# EAGLE schematic EMC02 (EAGLE 7.2.0)

## Sheet 1 of 2
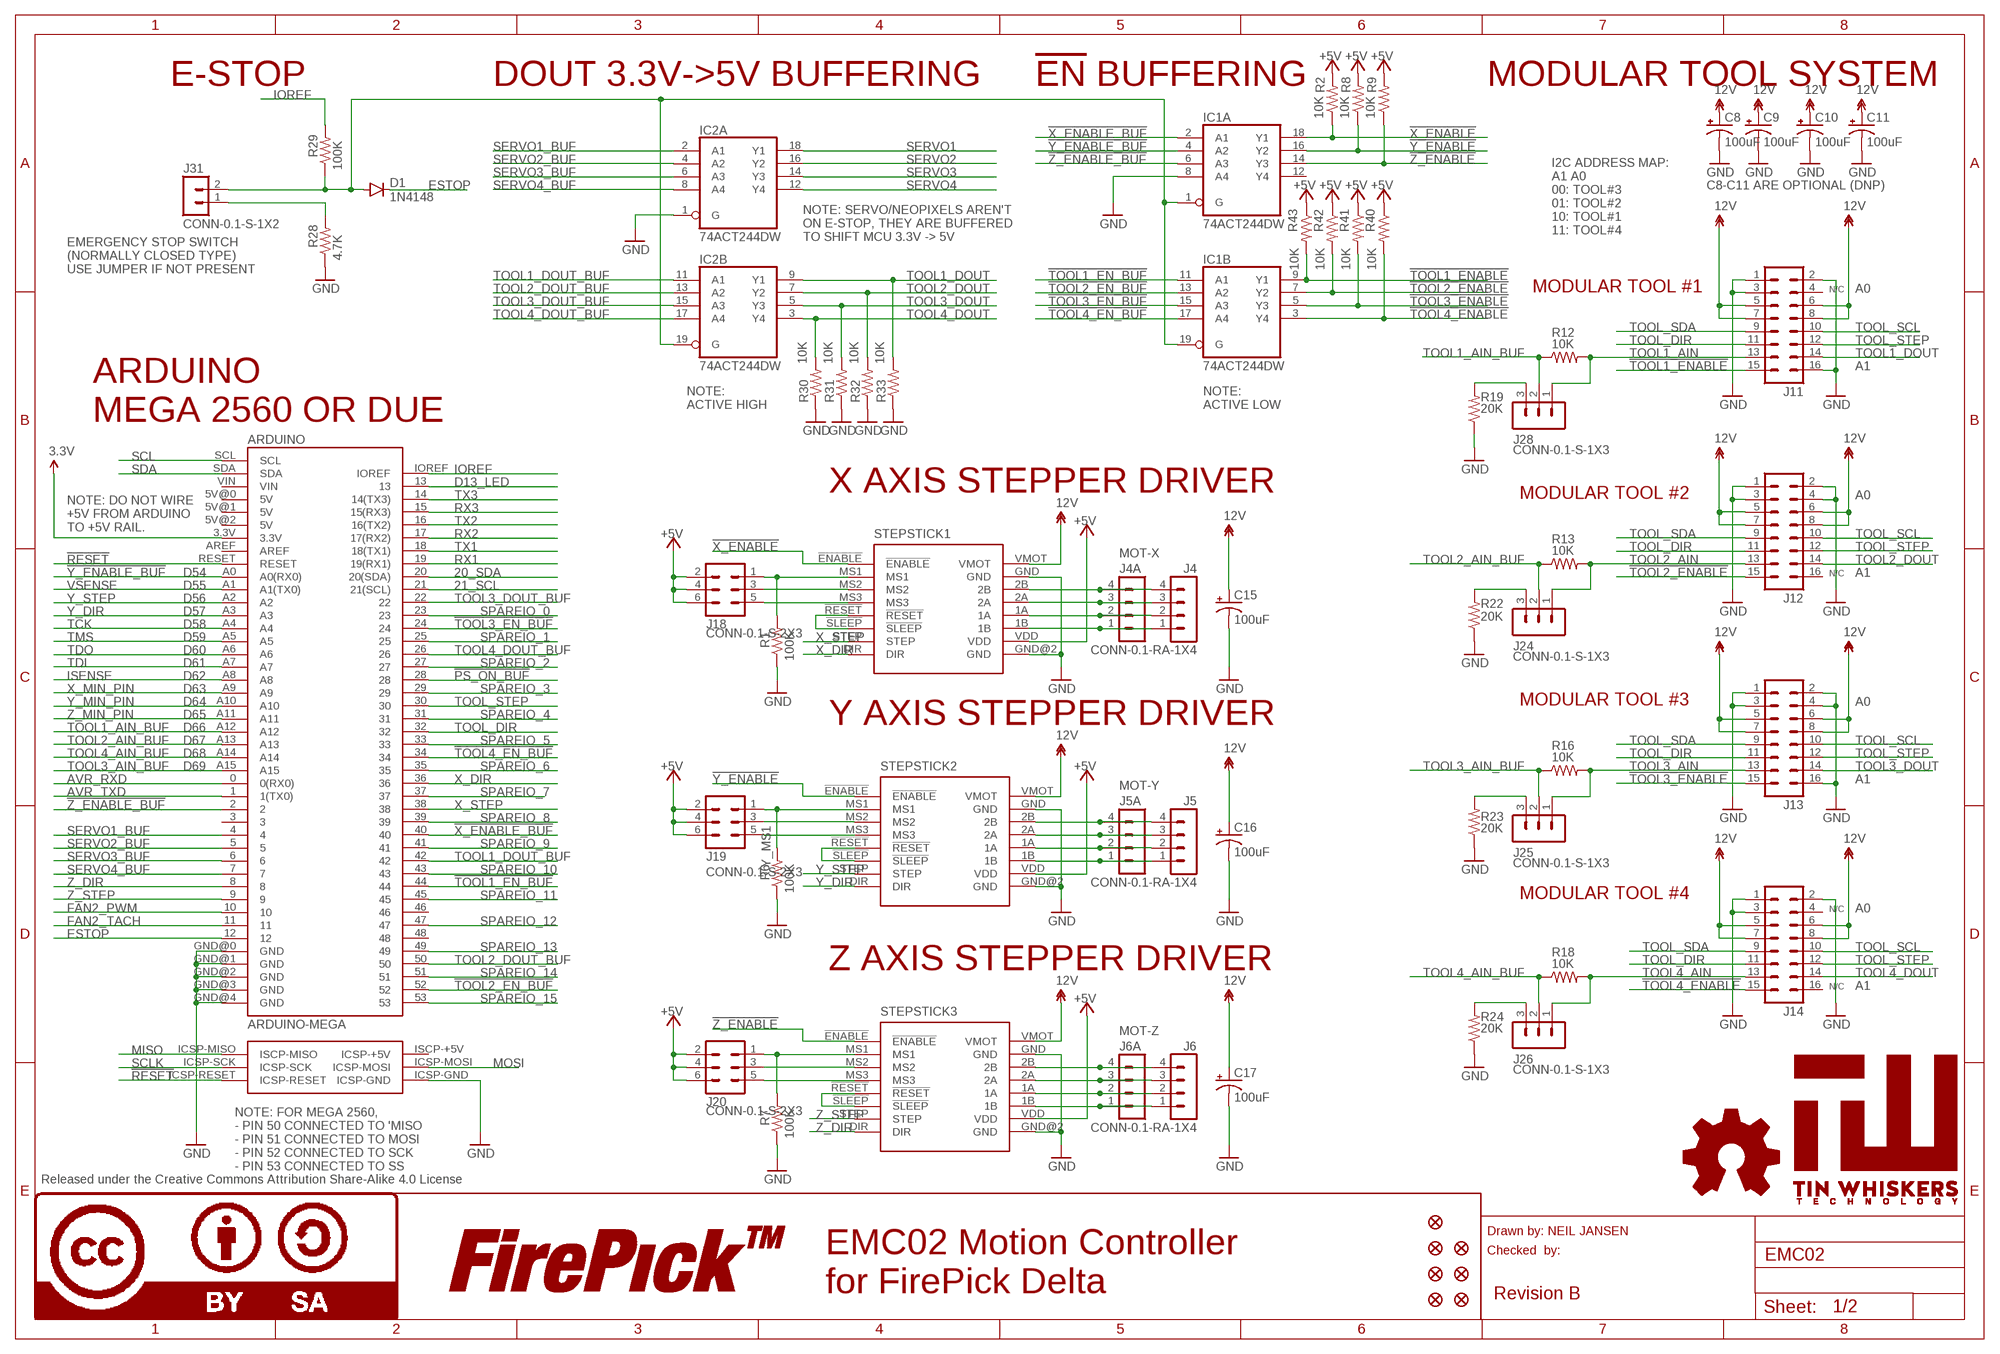
[diagram p0: schematic, sheet 1]

### Parts
ARDUINO  ARDUINO-MEGA  [ARDUINO-MEGA]
C8  100uF  CPOL-USD  [PANASONIC_D]
C9  100uF  CPOL-USD  [PANASONIC_D]
C10  100uF  CPOL-USD  [PANASONIC_D]
C11  100uF  CPOL-USD  [PANASONIC_D]
C15  100uF  CPOL-USD  [PANASONIC_D]
C16  100uF  CPOL-USD  [PANASONIC_D]
C17  100uF  CPOL-USD  [PANASONIC_D]
D1  1N4148  DIODESOD123  [SOD-123]
FID1  FIDUCIAL  [FIDUCIAL]
FID2  FIDUCIAL  [FIDUCIAL]
FID3  FIDUCIAL  [FIDUCIAL]
FID4  FIDUCIAL  [FIDUCIAL]
FID5  FIDUCIAL  [FIDUCIAL]
FID6  FIDUCIAL  [FIDUCIAL]
FID7  FIDUCIAL  [FIDUCIAL]
IC1  74ACT244DW  [SO20W]
IC2  74ACT244DW  [SO20W]
J4  CONN-0.1-RA-1X4  MA04-1  [MA04-1]
J4A  MOT-X  CONN-RECT-4PINJST-PH-2MM  [CONN-JST-PH_2.0MM_4PIN-SMT-RA]
J5  CONN-0.1-RA-1X4  MA04-1  [MA04-1]
J5A  MOT-Y  CONN-RECT-4PINJST-PH-2MM  [CONN-JST-PH_2.0MM_4PIN-SMT-RA]
J6  CONN-0.1-RA-1X4  MA04-1  [MA04-1]
J6A  MOT-Z  CONN-RECT-4PINJST-PH-2MM  [CONN-JST-PH_2.0MM_4PIN-SMT-RA]
J11  CONN-RECT-16PIN-2ROW  [CONN-RECT-2.54MM-16PIN-2ROW-SMTH]
J12  CONN-RECT-16PIN-2ROW  [CONN-RECT-2.54MM-16PIN-2ROW-SMTH]
J13  CONN-RECT-16PIN-2ROW  [CONN-RECT-2.54MM-16PIN-2ROW-SMTH]
J14  CONN-RECT-16PIN-2ROW  [CONN-RECT-2.54MM-16PIN-2ROW-SMTH]
J18  CONN-0.1-S-2X3  MA03-2  [MA03-2]
J19  CONN-0.1-S-2X3  MA03-2  [MA03-2]
J20  CONN-0.1-S-2X3  MA03-2  [MA03-2]
J24  CONN-0.1-S-1X3  MA03-1  [MA03-1]
J25  CONN-0.1-S-1X3  MA03-1  [MA03-1]
J26  CONN-0.1-S-1X3  MA03-1  [MA03-1]
J28  CONN-0.1-S-1X3  MA03-1  [MA03-1]
J31  CONN-0.1-S-1X2  MA02-1  [MA02-1]
LOGO4  LOGO-FIREPICKLARGE  [LOGO-FIREPICK]
LOGO5  LOGO-OSHWMEDIUM  [LOGO-OSHW-MEDIUM]
LOGO6  LOGO-CC-BY-SALARGE  [LOGO-CC-BY-SA]
R1  100K  RESISTOR0805-RES  [0805]
R2  10K  RESISTOR0805-RES  [0805]
R6  100K  RESISTOR0805-RES  [0805]
R7  100K  RESISTOR0805-RES  [0805]
R8  10K  RESISTOR0805-RES  [0805]
R9  10K  RESISTOR0805-RES  [0805]
R12  10K  RESISTOR0805-RES  [0805]
R13  10K  RESISTOR0805-RES  [0805]
R16  10K  RESISTOR0805-RES  [0805]
R18  10K  RESISTOR0805-RES  [0805]
R19  20K  RESISTOR0805-RES  [0805]
R22  20K  RESISTOR0805-RES  [0805]
R23  20K  RESISTOR0805-RES  [0805]
R24  20K  RESISTOR0805-RES  [0805]
R28  4.7K  RESISTOR0805-RES  [0805]
R29  100K  RESISTOR0805-RES  [0805]
R30  10K  RESISTOR0805-RES  [0805]
R31  10K  RESISTOR0805-RES  [0805]
R32  10K  RESISTOR0805-RES  [0805]
R33  10K  RESISTOR0805-RES  [0805]
R40  10K  RESISTOR0805-RES  [0805]
R41  10K  RESISTOR0805-RES  [0805]
R42  10K  RESISTOR0805-RES  [0805]
R43  10K  RESISTOR0805-RES  [0805]
STEPSTICK1  STEPSTICK  [STEPSTICK]
STEPSTICK2  STEPSTICK  [STEPSTICK]
STEPSTICK3  STEPSTICK  [STEPSTICK]
U$25  TIN-WHISKERSTSTOP  [TIN-WHISKERS-TSTOP]

### Nets
3.3V: ARDUINO.3.3V ; also sheet 2
12V: C8.+ C9.+ C10.+ C11.+ C15.+ C16.+ C17.+ J11.5 J11.6 J11.7 J11.8 J12.5 J12.6 J12.7 J12.8 J13.5 J13.6 J13.7 J13.8 J14.5 J14.6 J14.7 J14.8 STEPSTICK1.VMOT STEPSTICK2.VMOT STEPSTICK3.VMOT ; also sheet 2
20_SDA: ARDUINO.20(20(SDA)) ; also sheet 2
21_SCL: ARDUINO.21(21(SCL)) ; also sheet 2
!PS_ON_BUF: ARDUINO.28 ; also sheet 2
!RESET: ARDUINO.ICSP-RESET ARDUINO.RESET ; also sheet 2
!TOOL1_EN_BUF: ARDUINO.44 IC1.11(B:A1)
!TOOL1_ENABLE: IC1.9(B:Y1) J11.15 R43.2
!TOOL2_EN_BUF: ARDUINO.52 IC1.13(B:A2)
!TOOL2_ENABLE: IC1.7(B:Y2) J12.15 R42.2
!TOOL3_EN_BUF: ARDUINO.24 IC1.15(B:A3)
!TOOL3_ENABLE: IC1.5(B:Y3) J13.15 R41.2
!TOOL4_EN_BUF: ARDUINO.34 IC1.17(B:A4)
!TOOL4_ENABLE: IC1.3(B:Y4) J14.15 R40.2
!X_ENABLE: IC1.18(A:Y1) R2.1 STEPSTICK1.!ENABLE!
!X_ENABLE_BUF: ARDUINO.40 IC1.2(A:A1)
!Y_ENABLE: IC1.16(A:Y2) R8.1 STEPSTICK2.!ENABLE!
!Y_ENABLE_BUF: ARDUINO.A0(A0(RX0)) IC1.4(A:A2)
!Z_ENABLE: IC1.14(A:Y3) R9.1 STEPSTICK3.!ENABLE!
!Z_ENABLE_BUF: ARDUINO.2 IC1.6(A:A3)
+5V [power]: J18.2 J18.4 J18.6 J19.2 J19.4 J19.6 J20.2 J20.4 J20.6 R2.2 R8.2 R9.2 R40.1 R41.1 R42.1 R43.1 STEPSTICK1.VDD STEPSTICK2.VDD STEPSTICK3.VDD ; also sheet 2
AVR_RXD: ARDUINO.0(0(RX0)) ; also sheet 2
AVR_TXD: ARDUINO.1(1(TX0)) ; also sheet 2
D13_LED: ARDUINO.13 ; also sheet 2
ESTOP: ARDUINO.12 D1.C
ESTOP_OE: D1.A IC1.1(A:G) IC1.19(B:G) IC2.19(B:G) J31.2 R29.1
FAN2_PWM: ARDUINO.10 ; also sheet 2
FAN2_TACH: ARDUINO.11 ; also sheet 2
GND [power]: ARDUINO.GND@0(GND) ARDUINO.GND@1(GND) ARDUINO.GND@2(GND) ARDUINO.GND@3(GND) ARDUINO.GND@4(GND) ARDUINO.ICSP-GND C8.- C9.- C10.- C11.- C15.- C16.- C17.- IC1.8(A:A4) IC2.1(A:G) J11.1 J11.2 J11.3 J11.16 J12.1 J12.2 J12.3 J12.4 J13.1 J13.2 J13.3 J13.4 J13.16 J14.1 J14.2 J14.3 R1.1 R6.1 R7.1 R19.1 R22.1 R23.1 R24.1 R28.1 R30.1 R31.1 R32.1 R33.1 STEPSTICK1.GND STEPSTICK1.GND@2(GND) STEPSTICK2.GND STEPSTICK2.GND@2(GND) STEPSTICK3.GND STEPSTICK3.GND@2(GND) ; also sheet 2
IOREF: ARDUINO.IOREF R29.2 ; also sheet 2
ISENSE: ARDUINO.A8 ; also sheet 2
MISO: ARDUINO.ICSP-MISO(ISCP-MISO) ; also sheet 2
MOSI: ARDUINO.ICSP-MOSI ; also sheet 2
N$5: J31.1 R28.2
N$8: J24.3 R22.2
N$9: J28.3 R19.2
N$11: STEPSTICK1.!RESET! STEPSTICK1.!SLEEP!
N$13: J25.3 R23.2
N$14: J26.3 R24.2
N$16: STEPSTICK2.!RESET! STEPSTICK2.!SLEEP!
N$24: STEPSTICK3.!RESET! STEPSTICK3.!SLEEP!
RX1: ARDUINO.19(19(RX1)) ; also sheet 2
RX2: ARDUINO.17(17(RX2)) ; also sheet 2
RX3: ARDUINO.15(15(RX3)) ; also sheet 2
SCL [power]: ARDUINO.SCL ; also sheet 2
SCLK: ARDUINO.ICSP-SCK ; also sheet 2
SDA [power]: ARDUINO.SDA ; also sheet 2
SERVO1: IC2.18(A:Y1) ; also sheet 2
SERVO1_BUF: ARDUINO.4 IC2.2(A:A1)
SERVO2: IC2.16(A:Y2) ; also sheet 2
SERVO2_BUF: ARDUINO.5 IC2.4(A:A2)
SERVO3: IC2.14(A:Y3) ; also sheet 2
SERVO3_BUF: ARDUINO.6 IC2.6(A:A3)
SERVO4: IC2.12(A:Y4) ; also sheet 2
SERVO4_BUF: ARDUINO.7 IC2.8(A:A4)
SPAREIO_0: ARDUINO.23 ; also sheet 2
SPAREIO_1: ARDUINO.25 ; also sheet 2
SPAREIO_2: ARDUINO.27 ; also sheet 2
SPAREIO_3: ARDUINO.29 ; also sheet 2
SPAREIO_4: ARDUINO.31 ; also sheet 2
SPAREIO_5: ARDUINO.33 ; also sheet 2
SPAREIO_6: ARDUINO.35 ; also sheet 2
SPAREIO_7: ARDUINO.37 ; also sheet 2
SPAREIO_8: ARDUINO.39 ; also sheet 2
SPAREIO_9: ARDUINO.41 ; also sheet 2
SPAREIO_10: ARDUINO.43 ; also sheet 2
SPAREIO_11: ARDUINO.45 ; also sheet 2
SPAREIO_12: ARDUINO.47 ; also sheet 2
SPAREIO_13: ARDUINO.49 ; also sheet 2
SPAREIO_14: ARDUINO.51 ; also sheet 2
SPAREIO_15: ARDUINO.53 ; also sheet 2
TCK: ARDUINO.A4 ; also sheet 2
TDI: ARDUINO.A7 ; also sheet 2
TDO: ARDUINO.A6 ; also sheet 2
TMS: ARDUINO.A5 ; also sheet 2
TOOL1_AIN: J11.13 J28.1 R12.2
TOOL1_AIN_BUF: ARDUINO.A12 J28.2 R12.1
TOOL1_DOUT: IC2.9(B:Y1) J11.14 R33.2
TOOL1_DOUT_BUF: ARDUINO.42 IC2.11(B:A1)
TOOL2_AIN: J12.13 J24.1 R13.2
TOOL2_AIN_BUF: ARDUINO.A13 J24.2 R13.1
TOOL2_DOUT: IC2.7(B:Y2) J12.14 R32.2
TOOL2_DOUT_BUF: ARDUINO.50 IC2.13(B:A2)
TOOL3_AIN: J13.13 J25.1 R16.2
TOOL3_AIN_BUF: ARDUINO.A15 J25.2 R16.1
TOOL3_DOUT: IC2.5(B:Y3) J13.14 R31.2
TOOL3_DOUT_BUF: ARDUINO.22 IC2.15(B:A3)
TOOL4_AIN: J14.13 J26.1 R18.2
TOOL4_AIN_BUF: ARDUINO.A14 J26.2 R18.1
TOOL4_DOUT: IC2.3(B:Y4) J14.14 R30.2
TOOL4_DOUT_BUF: ARDUINO.26 IC2.17(B:A4)
TOOL_DIR: ARDUINO.32 J11.11 J12.11 J13.11 J14.11
TOOL_SCL [power]: J11.10 J12.10 J13.10 J14.10 ; also sheet 2
TOOL_SDA [power]: J11.9 J12.9 J13.9 J14.9 ; also sheet 2
TOOL_STEP: ARDUINO.30 J11.12 J12.12 J13.12 J14.12
TX1: ARDUINO.18(18(TX1)) ; also sheet 2
TX2: ARDUINO.16(16(TX2)) ; also sheet 2
TX3: ARDUINO.14(14(TX3)) ; also sheet 2
VSENSE: ARDUINO.A1(A1(TX0)) ; also sheet 2
X1A: J4.2 J4A.2 STEPSTICK1.1A
X1B: J4.1 J4A.1 STEPSTICK1.1B
X2A: J4.3 J4A.3 STEPSTICK1.2A
X2B: J4.4 J4A.4 STEPSTICK1.2B
X_DIR: ARDUINO.36 STEPSTICK1.DIR
X_MIN_PIN: ARDUINO.A9 ; also sheet 2
X_MS1: J18.1 R1.2 STEPSTICK1.MS1
X_MS2: J18.3 STEPSTICK1.MS2
X_MS3: J18.5 STEPSTICK1.MS3
X_STEP: ARDUINO.38 STEPSTICK1.STEP
Y1A: J5.2 J5A.2 STEPSTICK2.1A
Y1B: J5.1 J5A.1 STEPSTICK2.1B
Y2A: J5.3 J5A.3 STEPSTICK2.2A
Y2B: J5.4 J5A.4 STEPSTICK2.2B
Y_DIR: ARDUINO.A3 STEPSTICK2.DIR
Y_MIN_PIN: ARDUINO.A10 ; also sheet 2
Y_MS1: J19.1 R6.2 STEPSTICK2.MS1
Y_MS2: J19.3 STEPSTICK2.MS2
Y_MS3: J19.5 STEPSTICK2.MS3
Y_STEP: ARDUINO.A2 STEPSTICK2.STEP
Z1A: J6.2 J6A.2 STEPSTICK3.1A
Z1B: J6.1 J6A.1 STEPSTICK3.1B
Z2A: J6.3 J6A.3 STEPSTICK3.2A
Z2B: J6.4 J6A.4 STEPSTICK3.2B
Z_DIR: ARDUINO.8 STEPSTICK3.DIR
Z_MIN_PIN: ARDUINO.A11 ; also sheet 2
Z_MS1 [power]: J20.1 R7.2 STEPSTICK3.MS1
Z_MS2: J20.3 STEPSTICK3.MS2
Z_MS3: J20.5 STEPSTICK3.MS3
Z_STEP: ARDUINO.9 STEPSTICK3.STEP
Unconnected: ARDUINO.3 ARDUINO.5V@0(5V) ARDUINO.5V@1(5V) ARDUINO.5V@2(5V) ARDUINO.46 ARDUINO.48 ARDUINO.AREF ARDUINO.ISCP-+5V(ICSP-+5V) ARDUINO.VIN IC1.12(A:Y4) J11.4 J12.16 J14.4 J14.16

### Notes on the sheet
- E-STOP | DOUT 3.3V->5V BUFFERING | !EN! BUFFERING | MODULAR TOOL SYSTEM
- C8-C11 ARE OPTIONAL (DNP)
- I2C ADDRESS MAP:
  A1 A0
  00: TOOL#3
  01: TOOL#2
  10: TOOL#1
  11: TOOL#4
- NOTE: SERVO/NEOPIXELS AREN'T 
  ON E-STOP, THEY ARE BUFFERED
  TO SHIFT MCU 3.3V -> 5V
- EMERGENCY STOP SWITCH
  (NORMALLY CLOSED TYPE)
  USE JUMPER IF NOT PRESENT
- MODULAR TOOL #1 | N/C | A0
- A1
- NOTE:
  ACTIVE HIGH
- NOTE:
  ACTIVE LOW
- ARDUINO 
  MEGA 2560 OR DUE
- X AXIS STEPPER DRIVER
- MODULAR TOOL #2 | A0
- NOTE: DO NOT WIRE 
  +5V FROM ARDUINO 
  TO +5V RAIL.
- D54 | N/C | A1
- D55
- D56
- D57
- D58
- D59
- D60
- D61
- D62
- D63
- D64 | MODULAR TOOL #3 | A0
- D65
- Y AXIS STEPPER DRIVER
- D66
- D67
- D68
- D69
- A1
- MODULAR TOOL #4
- N/C | A0
- Z AXIS STEPPER DRIVER
- N/C | A1
- NOTE: FOR MEGA 2560, 
  - PIN 50 CONNECTED TO 'MISO
  - PIN 51 CONNECTED TO MOSI
  - PIN 52 CONNECTED TO SCK
  - PIN 53 CONNECTED TO SS
- Released under the Creative Commons Attribution Share-Alike 4.0 License
- Drawn by: NEIL JANSEN
- Checked  by:
- EMC02 Motion Controller
  for FirePick Delta
- Revision B

## Sheet 2 of 2
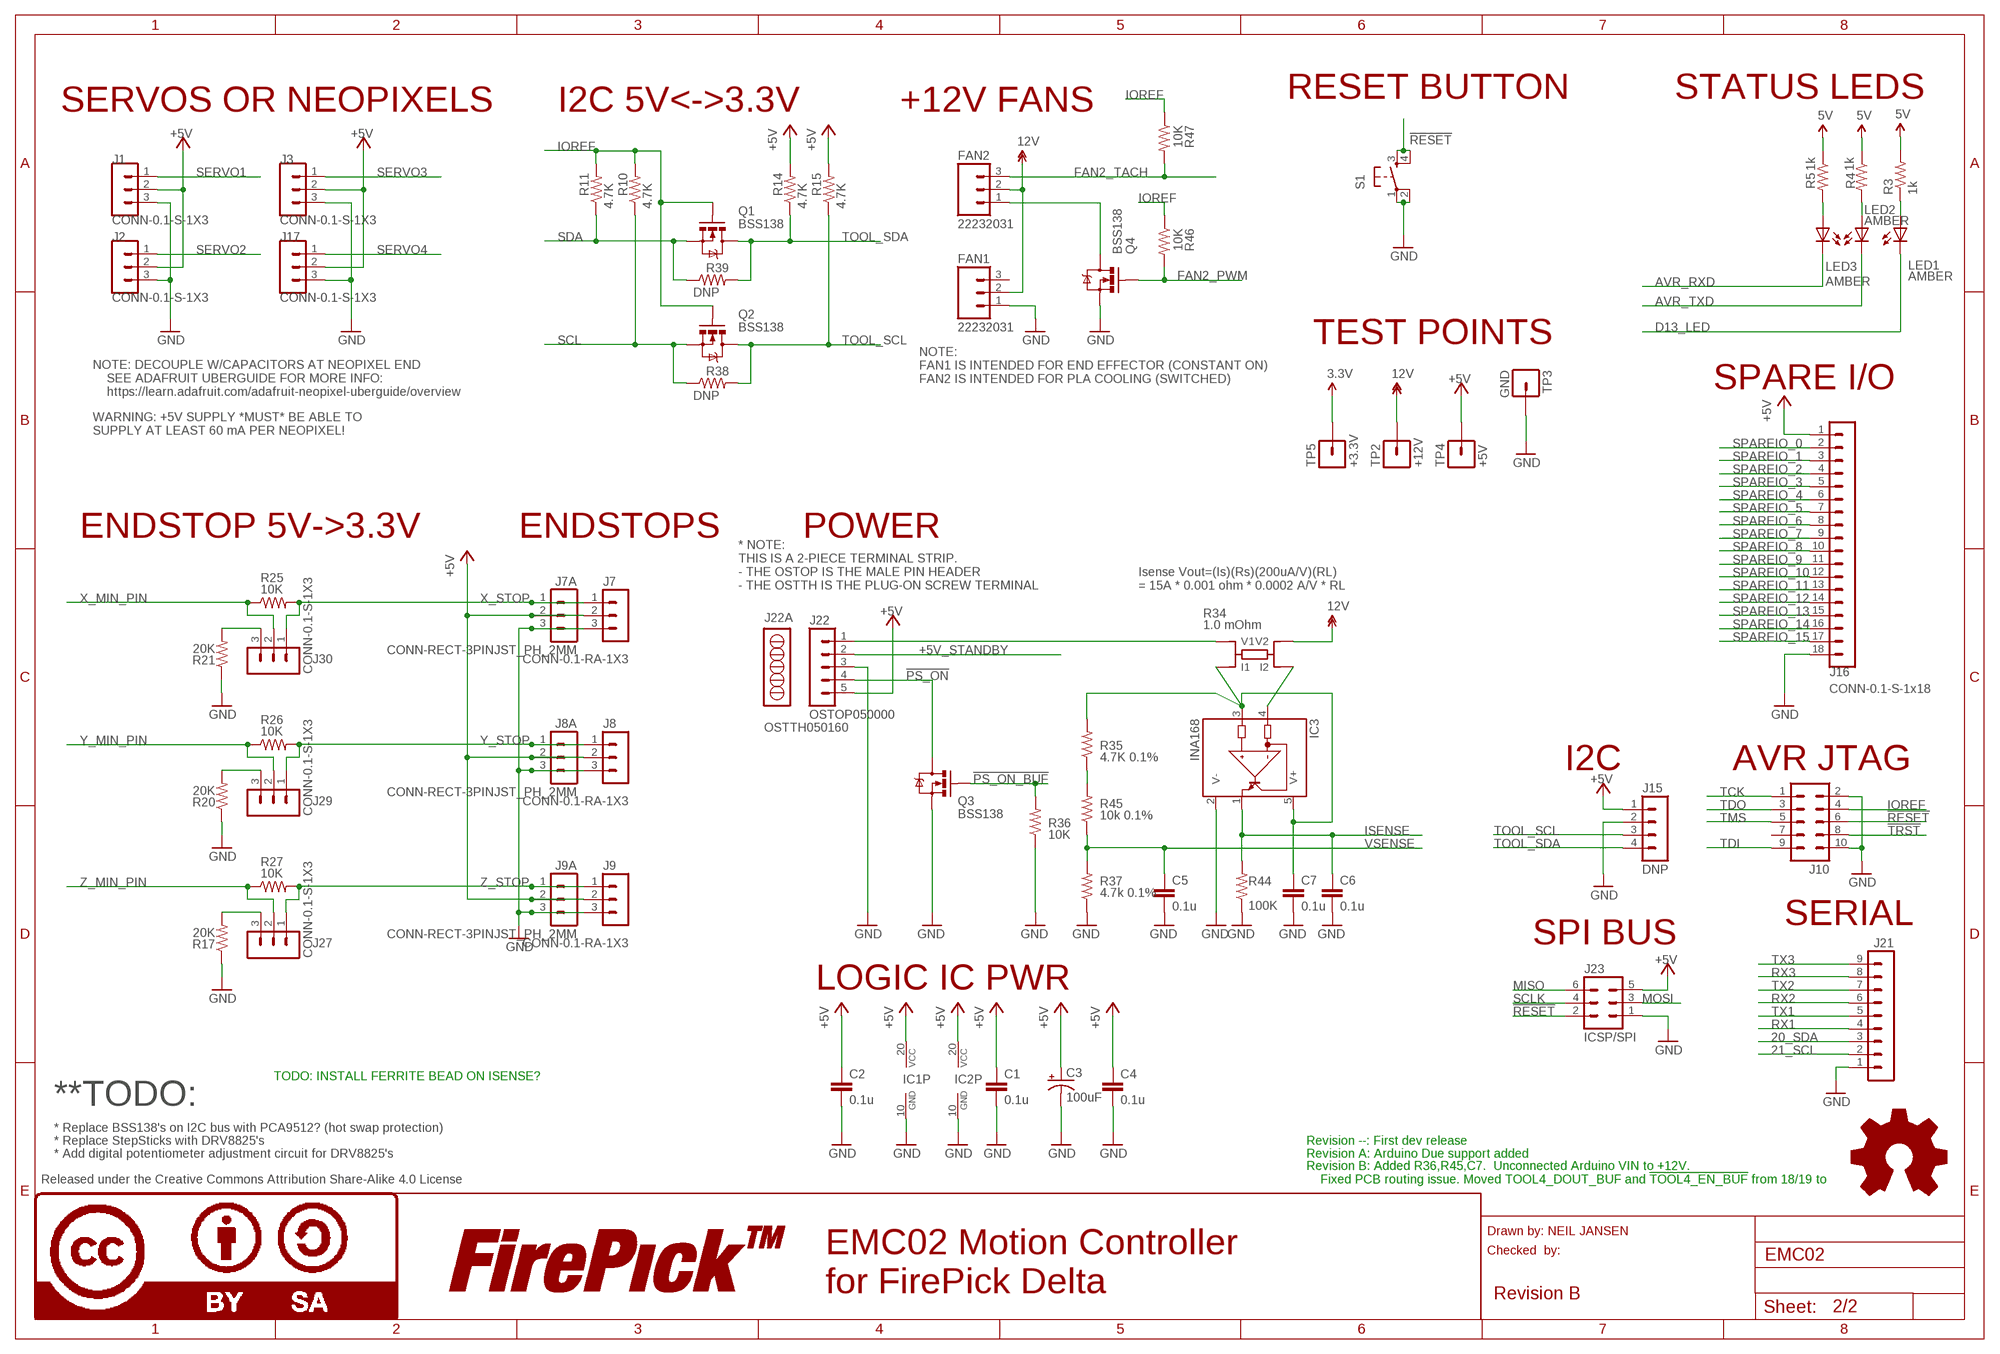
[diagram p1: schematic, sheet 2]

### Parts
C1  0.1u  CAP0805  [0805]
C2  0.1u  CAP0805  [0805]
C3  100uF  CPOL-USD  [PANASONIC_D]
C4  0.1u  CAP0805  [0805]
C5  0.1u  CAP0805  [0805]
C6  0.1u  CAP0805  [0805]
C7  0.1u  CAP0805  [0805]
FAN1  22232031  M03POLAR_LOCK  [MOLEX-1X3_LOCK]
FAN2  22232031  M03POLAR_LOCK  [MOLEX-1X3_LOCK]
IC3  INA168  [SOT23-5]
J1  CONN-0.1-S-1X3  MA03-1  [MA03-1]
J2  CONN-0.1-S-1X3  MA03-1  [MA03-1]
J3  CONN-0.1-S-1X3  MA03-1  [MA03-1]
J7  CONN-0.1-RA-1X3  MA03-1  [MA03-1]
J7A  CONN-RECT-3PINJST_PH_2MM  [CONN-JST_PH-2.0MM-3PIN-SMT-RA]
J8  CONN-0.1-RA-1X3  MA03-1  [MA03-1]
J8A  CONN-RECT-3PINJST_PH_2MM  [CONN-JST_PH-2.0MM-3PIN-SMT-RA]
J9  CONN-0.1-RA-1X3  MA03-1  [MA03-1]
J9A  CONN-RECT-3PINJST_PH_2MM  [CONN-JST_PH-2.0MM-3PIN-SMT-RA]
J10  MA05-2  [MA05-2]
J15  DNP  MA04-1  [MA04-1]
J16  CONN-0.1-S-1x18  MA18-1  [MA18-1]
J17  CONN-0.1-S-1X3  MA03-1  [MA03-1]
J21  MA09-1  [MA09-1]
J22  OSTOP050000  CONN-OSTOP050000  [CONN-OSTOP050000]
J22A  OSTTH050160  CONN-OSTTH050160  [CONN-OSTTH050160]
J23  ICSP/SPI  MA03-2  [MA03-2]
J27  CONN-0.1-S-1X3  MA03-1  [MA03-1]
J29  CONN-0.1-S-1X3  MA03-1  [MA03-1]
J30  CONN-0.1-S-1X3  MA03-1  [MA03-1]
LED1  AMBER  LED1206-NS  [LED-1206-NO_SILK]
LED2  AMBER  LED1206-NS  [LED-1206-NO_SILK]
LED3  AMBER  LED1206-NS  [LED-1206-NO_SILK]
LOGO1  LOGO-FIREPICKLARGE  [LOGO-FIREPICK]
LOGO2  LOGO-OSHWMEDIUM  [LOGO-OSHW-MEDIUM]
LOGO3  LOGO-CC-BY-SALARGE  [LOGO-CC-BY-SA]
Q1  BSS138  MOSFET-NCHANNELBSS138  [SOT23]
Q2  BSS138  MOSFET-NCHANNELBSS138  [SOT23]
Q3  BSS138  MOSFET-NCHANNELBSS138  [SOT23]
Q4  BSS138  MOSFET-NCHANNELBSS138  [SOT23]
R3  1k  RESISTOR0805-RES  [0805]
R4  1k  RESISTOR0805-RES  [0805]
R5  1k  RESISTOR0805-RES  [0805]
R10  4.7K  RESISTOR0805-RES  [0805]
R11  4.7K  RESISTOR0805-RES  [0805]
R14  4.7K  RESISTOR0805-RES  [0805]
R15  4.7K  RESISTOR0805-RES  [0805]
R17  20K  RESISTOR0805-RES  [0805]
R20  20K  RESISTOR0805-RES  [0805]
R21  20K  RESISTOR0805-RES  [0805]
R25  10K  RESISTOR0805-RES  [0805]
R26  10K  RESISTOR0805-RES  [0805]
R27  10K  RESISTOR0805-RES  [0805]
R34  1.0 mOhm  RESISTOR-KELVIN  [CHIP-1224-KELVIN]
R35  4.7K 0.1%  RESISTOR0805-RES  [0805]
R36  10K  RESISTOR0805-RES  [0805]
R37  4.7k 0.1%  RESISTOR0805-RES  [0805]
R38  DNP  RESISTOR0805-RES  [0805]
R39  DNP  RESISTOR0805-RES  [0805]
R44  100K  RESISTOR0805-RES  [0805]
R45  10k 0.1%  RESISTOR0805-RES  [0805]
R46  10K  RESISTOR0805-RES  [0805]
R47  10K  RESISTOR0805-RES  [0805]
S1  TAC_SWITCHSMD  [TACTILE_SWITCH_SMD]
TP2  +12V  CONN-TESTPOINT  [CON-TESTPOINT]
TP3  GND  CONN-TESTPOINT  [CON-TESTPOINT]
TP4  +5V  CONN-TESTPOINT  [CON-TESTPOINT]
TP5  +3.3V  CONN-TESTPOINT  [CON-TESTPOINT]

### Nets
3.3V: TP5.1 ; also sheet 1
12V: FAN1.2 FAN2.2 R34.V2 TP2.1 ; also sheet 1
20_SDA: J21.3 ; also sheet 1
21_SCL: J21.2 ; also sheet 1
!PS_ON: J22.4 Q3.3(D)
!PS_ON_BUF: Q3.1(G) R36.2 ; also sheet 1
!RESET: J10.6 J23.2 S1.3 S1.4 ; also sheet 1
!TRST: J10.8
+5V [power]: C1.1 C2.1 C3.+ C4.1 IC1.20(P:VCC) IC2.20(P:VCC) J1.2 J2.2 J3.2 J7.2 J7A.2 J8.2 J8A.2 J9.2 J9A.2 J15.1 J16.1 J17.2 J22.5 J23.5 R3.2 R4.1 R5.1 R14.2 R15.2 TP4.1 ; supply symbol labelled 5V ; also sheet 1
+5V_STANDBY: J22.2
AVR_RXD: LED3.C ; also sheet 1
AVR_TXD: LED2.C ; also sheet 1
D13_LED: LED1.C ; also sheet 1
FAN2_PWM: Q4.1(G) R46.2 ; also sheet 1
FAN2_TACH: FAN2.3 R47.2 ; also sheet 1
GND [power]: C1.2 C2.2 C3.- C4.2 C5.2 C6.2 C7.2 FAN1.1 IC1.10(P:GND) IC2.10(P:GND) IC3.2(V-) J1.3 J2.3 J3.3 J7.3 J7A.3 J8.3 J8A.3 J9.3 J9A.3 J10.2 J10.10 J15.2 J16.18 J17.3 J21.1 J22.3 J23.1 Q3.2(S) Q4.2(S) R17.1 R20.1 R21.1 R36.1 R37.1 R44.1 S1.1 S1.2 TP3.1 ; also sheet 1
IOREF: J10.4 Q1.1(G) Q2.1(G) R10.2 R11.2 R46.1 R47.1 ; also sheet 1
ISENSE: C6.1 IC3.1(OUT) R44.2 ; also sheet 1
MISO: J23.6 ; also sheet 1
MOSI: J23.3 ; also sheet 1
N$1: R35.1 R45.2
N$2: FAN2.1 Q4.3(D)
N$3: J22.1 R34.V1
N$4: LED1.A R3.1
N$10: J27.3 R17.2
N$12: J29.3 R20.2
N$15: J30.3 R21.2
N$17: C7.1 IC3.3(IN+) IC3.5(V+) R34.I1 R35.2
N$18: IC3.4(IN-) R34.I2
N$21: LED2.A R4.2
N$22: LED3.A R5.2
RX1: J21.4 ; also sheet 1
RX2: J21.6 ; also sheet 1
RX3: J21.8 ; also sheet 1
SCL [power]: Q2.2(S) R10.1 R38.1 ; also sheet 1
SCLK: J23.4 ; also sheet 1
SDA [power]: Q1.2(S) R11.1 R39.1 ; also sheet 1
SERVO1: J1.1 ; also sheet 1
SERVO2: J2.1 ; also sheet 1
SERVO3: J3.1 ; also sheet 1
SERVO4: J17.1 ; also sheet 1
SPAREIO_0: J16.2 ; also sheet 1
SPAREIO_1: J16.3 ; also sheet 1
SPAREIO_2: J16.4 ; also sheet 1
SPAREIO_3: J16.5 ; also sheet 1
SPAREIO_4: J16.6 ; also sheet 1
SPAREIO_5: J16.7 ; also sheet 1
SPAREIO_6: J16.8 ; also sheet 1
SPAREIO_7: J16.9 ; also sheet 1
SPAREIO_8: J16.10 ; also sheet 1
SPAREIO_9: J16.11 ; also sheet 1
SPAREIO_10: J16.12 ; also sheet 1
SPAREIO_11: J16.13 ; also sheet 1
SPAREIO_12: J16.14 ; also sheet 1
SPAREIO_13: J16.15 ; also sheet 1
SPAREIO_14: J16.16 ; also sheet 1
SPAREIO_15: J16.17 ; also sheet 1
TCK: J10.1 ; also sheet 1
TDI: J10.9 ; also sheet 1
TDO: J10.3 ; also sheet 1
TMS: J10.5 ; also sheet 1
TOOL_SCL [power]: J15.3 Q2.3(D) R15.1 R38.2 ; also sheet 1
TOOL_SDA [power]: J15.4 Q1.3(D) R14.1 R39.2 ; also sheet 1
TX1: J21.5 ; also sheet 1
TX2: J21.7 ; also sheet 1
TX3: J21.9 ; also sheet 1
VSENSE: C5.1 R37.2 R45.1 ; also sheet 1
X_MIN_PIN: J30.2 R25.1 ; also sheet 1
X_STOP: J7.1 J7A.1 J30.1 R25.2
Y_MIN_PIN: J29.2 R26.1 ; also sheet 1
Y_STOP: J8.1 J8A.1 J29.1 R26.2
Z_MIN_PIN: J27.2 R27.1 ; also sheet 1
Z_STOP: J9.1 J9A.1 J27.1 R27.2
Unconnected: FAN1.3 J10.7

### Notes on the sheet
- RESET BUTTON | STATUS LEDS
- SERVOS OR NEOPIXELS | I2C 5V<->3.3V | +12V FANS
- TEST POINTS
- NOTE: 
  FAN1 IS INTENDED FOR END EFFECTOR (CONSTANT ON)
  FAN2 IS INTENDED FOR PLA COOLING (SWITCHED)
- SPARE I/O
- NOTE: DECOUPLE W/CAPACITORS AT NEOPIXEL END
      SEE ADAFRUIT UBERGUIDE FOR MORE INFO:
      https://learn.adafruit.com/adafruit-neopixel-uberguide/overview
- WARNING: +5V SUPPLY *MUST* BE ABLE TO 
  SUPPLY AT LEAST 60 mA PER NEOPIXEL!
- ENDSTOP 5V->3.3V | ENDSTOPS | POWER
- * NOTE: 
  THIS IS A 2-PIECE TERMINAL STRIP.
  - THE OSTOP IS THE MALE PIN HEADER
  - THE OSTTH IS THE PLUG-ON SCREW TERMINAL
- Isense Vout=(Is)(Rs)(200uA/V)(RL)
  = 15A * 0.001 ohm * 0.0002 A/V * RL
- I2C | AVR JTAG
- SERIAL
- SPI BUS
- LOGIC IC PWR
- TODO: INSTALL FERRITE BEAD ON ISENSE?
- **TODO:
- * Replace BSS138's on I2C bus with PCA9512? (hot swap protection)
- * Replace StepSticks with DRV8825's | Revision --: First dev release
- * Add digital potentiometer adjustment circuit for DRV8825's | Revision A: Arduino Due support added
- Released under the Creative Commons Attribution Share-Alike 4.0 License
- Revision B: Added R36,R45,C7.  Unconnected Arduino VIN to +12V.  
      Fixed PCB routing issue. Moved TOOL4_DOUT_BUF and !TOOL4_EN_BUF! from 18/19 to
- Drawn by: NEIL JANSEN
- Checked  by:
- EMC02 Motion Controller
  for FirePick Delta
- Revision B

## Library data of the parts
ARDUINO = FirePick:ARDUINO-MEGA; PARTNO: CONN-0.1-ARD-2560
C1 C2 C4 = SparkFun-Capacitors:CAP: Capacitor Standard 0603 ceramic capacitor, and 0.1" leaded capacitor.; PARTNO: CC0805ZRY5V9BB104
C3 C15-C17 = rcl:CPOL-US: POLARIZED CAPACITOR, American symbol; PARTNO: 25TXV100M6.3X8
C5-C7 = SparkFun-Capacitors:CAP: Capacitor Standard 0603 ceramic capacitor, and 0.1" leaded capacitor.; DNP: T; PARTNO: CC0805ZRY5V9BB104
C8-C11 = rcl:CPOL-US: POLARIZED CAPACITOR, American symbol; DNP: T; PARTNO: 25TXV100M6.3X8
D1 = SparkFun-DiscreteSemi:DIODE: Diode These are standard reverse protection diodes and small signal diodes. SMA package can handle up to about 1A. SOD-323 can handle about 200mA. What the SOD-323 package when ordering, there are some mfgs out there that are 5-pin packages.; PARTNO: 1N4148W-7-F
FAN1 FAN2 = SparkFun-Connectors:M03: Header 3 Standard 3-pin 0.1" header. Use with straight break away headers (SKU : PRT-00116), right angle break away headers (PRT-00553), swiss pins (PRT-00743), machine pins (PRT-00117), and female headers (PRT-00115). Molex polarized connector foot print use with SKU : PRT-08232 with associated crimp pins and housings.; PARTNO: 22232031
FID1-FID7 = FirePick:FIDUCIAL; BOM: EXCLUDE
IC1 IC2 = 74xx-eu:74*244: Octal BUFFER and LINE DRIVER, 3-state; PARTNO: 74ACT244SCX
IC3 = burr-brown:INA168: High-Side Measurement Current Shunt Monitor; DNP: T; MF: TEXAS INSTRUMENTS; MPN: INA168NA/250; OC_FARNELL: 4375737; OC_NEWARK: 35C1744; PARTNO: INA168NA/3K
J1-J3 J17 J24-J30 = !con-lstb:MA03-1: PIN HEADER; PARTNO: CONN-0.1-S-1X3
J4-J6 = !con-lstb:MA04-1: PIN HEADER; PARTNO: CONN-0.1-RA-1X4
J4A J5A J6A = FirePick:CONN-RECT-4PIN; DNP: T
J7-J9 = !con-lstb:MA03-1: PIN HEADER; PARTNO: CONN-0.1-RA-1X3
J7A J8A J9A = FirePick:CONN-RECT-3PIN; DNP: T
J10 = !con-lstb:MA05-2: PIN HEADER; DNP: T
J11-J14 = FirePick:CONN-RECT-16PIN-2ROW; PARTNO: PPPC081LFBN-RC
J15 = !con-lstb:MA04-1: PIN HEADER; DNP: T
J16 = !con-lstb:MA18-1; DNP: T
J18-J20 = !con-lstb:MA03-2: PIN HEADER; PARTNO: CONN-0.1-S-2X3
J21 = !con-lstb:MA09-1: PIN HEADER; DNP: T
J22 = FirePick:CONN-OSTOP050000; PARTNO: OSTOP240000
J22A = FirePick:CONN-OSTTH050160; PARTNO: OSTTH050160
J23 = !con-lstb:MA03-2: PIN HEADER; DNP: T
J31 = !con-lstb:MA02-1; PARTNO: CONN-0.1-S-1X2
LED1-LED3 = SparkFun-LED:LED: LEDs Standard schematic elements and footprints for 5mm, 3mm, 1206, and 0603 sized LEDs. 5mm - Spark Fun Electronics SKU : COM-00529 (and others); PARTNO: LTST-C150AKT
LOGO1 LOGO4 = FirePick:LOGO-FIREPICK; BOM: EXCLUDE
LOGO2 LOGO5 = FirePick:LOGO-OSHW; BOM: EXCLUDE
LOGO3 LOGO6 = FirePick:LOGO-CC-BY-SA; BOM: EXCLUDE
Q1-Q4 = SparkFun-DiscreteSemi:MOSFET-NCHANNEL: Common NMOSFET Parts MFG P/N Store ID Prod ID FDD8780 TRANS-09984 SI7820DN TRANS-11055 FDS6630A IC-08089 2N7002PW TRANS-11151 FQP30N06L COM-10213 TRANS-10060 BSS123LT1G TRANS-08345 BSS138 TRANS-00830 BS170 2N7000; PARTNO: BSS138; PROD_ID: TRANS-00830
R1 R6 R7 R29 = SparkFun-Resistors:RESISTOR: Resistor Basic schematic elements and footprints for 0603, 1206, and PTH resistors.; PARTNO: RC0805FR-07100KL
R2 R8 R9 R12 R13 R16 R18 R25-R27 R30-R33 R36 R40-R43 R46 R47 = SparkFun-Resistors:RESISTOR: Resistor Basic schematic elements and footprints for 0603, 1206, and PTH resistors.; PARTNO: RC0805FR-0710KL
R3-R5 = SparkFun-Resistors:RESISTOR: Resistor Basic schematic elements and footprints for 0603, 1206, and PTH resistors.; PARTNO: RC0805FR-071KL
R10 R11 R14 R15 R28 = SparkFun-Resistors:RESISTOR: Resistor Basic schematic elements and footprints for 0603, 1206, and PTH resistors.; PARTNO: RC0805FR-074K7L
R17 R19-R24 = SparkFun-Resistors:RESISTOR: Resistor Basic schematic elements and footprints for 0603, 1206, and PTH resistors.; PARTNO: RC0805FR-0720KL
R34 = FirePick:RESISTOR-KELVIN; PARTNO: LVK25R001FER
R35 R37 R44 R45 = SparkFun-Resistors:RESISTOR: Resistor Basic schematic elements and footprints for 0603, 1206, and PTH resistors.; DNP: T; PARTNO: *
R38 R39 = SparkFun-Resistors:RESISTOR: Resistor Basic schematic elements and footprints for 0603, 1206, and PTH resistors.; DNP: T
S1 = SparkFun:TAC_SWITCH: Momentary Switch Button commonly used for reset or general input. Spark Fun Electronics SKU : COM-00097; PARTNO: SWITCH TACTILE SPST-NO 0.05A 12V
STEPSTICK1-STEPSTICK3 = FirePick:STEPSTICK; PARTNO: PPPC081LFBN-RC
TP2-TP5 = FirePick:CONN-TESTPOINT; DNP: T
U$25 = !tin-whiskers:TIN-WHISKERS

## Net classes
0 default: width 0.152 mm, drill 0.305 mm, clearance 0.152 mm